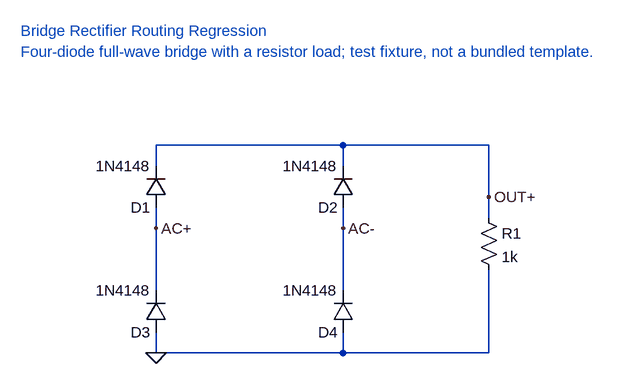
[diagram p0: schematic bridge_rectifier.asc]
bridge_rectifier.asc, the LTspice schematic file:
Version 4
SHEET 1 1200 800
TEXT 16 16 Left 2 ;Bridge Rectifier Routing Regression
TEXT 16 48 Left 2 ;Four-diode full-wave bridge with a resistor load; test fixture, not a bundled template.
SYMBOL diode 240 288 R180
SYMATTR InstName D1
SYMATTR Value 1N4148
SYMBOL diode 528 288 R180
SYMATTR InstName D2
SYMATTR Value 1N4148
SYMBOL diode 240 480 R180
SYMATTR InstName D3
SYMATTR Value 1N4148
SYMBOL diode 528 480 R180
SYMATTR InstName D4
SYMATTR Value 1N4148
SYMBOL res 720 288 R0
SYMATTR InstName R1
SYMATTR Value 1k
FLAG 224 320 AC+
WIRE 224 288 224 320
WIRE 224 320 224 384
WIRE 224 384 224 416
FLAG 512 320 AC-
WIRE 512 288 512 320
WIRE 512 320 512 384
WIRE 512 384 512 416
FLAG 736 272 OUT+
WIRE 224 192 224 224
WIRE 224 192 512 192
WIRE 512 192 512 224
WIRE 512 192 736 192
WIRE 736 192 736 272
WIRE 736 272 736 304
FLAG 224 512 0
WIRE 224 480 224 512
WIRE 224 512 512 512
WIRE 512 480 512 512
WIRE 512 512 736 512
WIRE 736 384 736 416
WIRE 736 416 736 512

The netlist it stands for:
* bridge_rectifier.asc
D1 AC+ OUT+ 1N4148
D2 AC- OUT+ 1N4148
D3 0 AC+ 1N4148
D4 0 AC- 1N4148
R1 OUT+ 0 1k
.model D D
.lib standard.dio
* Bridge Rectifier Routing Regression
* Four-diode full-wave bridge with a resistor load; test fixture, not a bundled template.
.backanno
.end